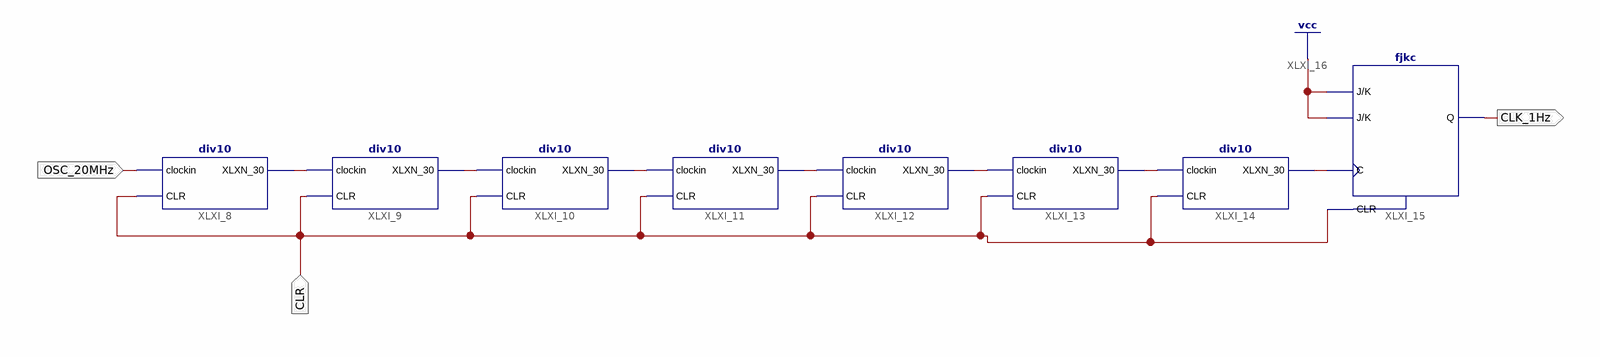
[diagram p0: schematic sheet 1]
// Xilinx ISE schematic Divisor_20M.sch (spartan6) as structural Verilog: 8 symbols, 3 ports
module Divisor_20M (
  input  CLR,
  input  OSC_20MHz,
  output CLK_1Hz
);

  wire XLXN_7, XLXN_8, XLXN_9, XLXN_10, XLXN_11, XLXN_12, XLXN_13;

  div10 XLXI_8 (.clockin(OSC_20MHz), .CLR(CLR), .XLXN_30(XLXN_7));
  div10 XLXI_9 (.clockin(XLXN_7), .CLR(CLR), .XLXN_30(XLXN_8));
  div10 XLXI_10 (.clockin(XLXN_8), .CLR(CLR), .XLXN_30(XLXN_9));
  div10 XLXI_11 (.clockin(XLXN_9), .CLR(CLR), .XLXN_30(XLXN_10));
  div10 XLXI_12 (.clockin(XLXN_10), .CLR(CLR), .XLXN_30(XLXN_11));
  div10 XLXI_13 (.clockin(XLXN_11), .CLR(CLR), .XLXN_30(XLXN_12));
  div10 XLXI_14 (.clockin(XLXN_12), .CLR(CLR), .XLXN_30(XLXN_13));
  fjkc XLXI_15 (.C(XLXN_13), .CLR(CLR), .J(1'b1), .K(1'b1), .Q(CLK_1Hz));
endmodule
